# Altium schematic sheet 3V3 rail.SchDoc
size A
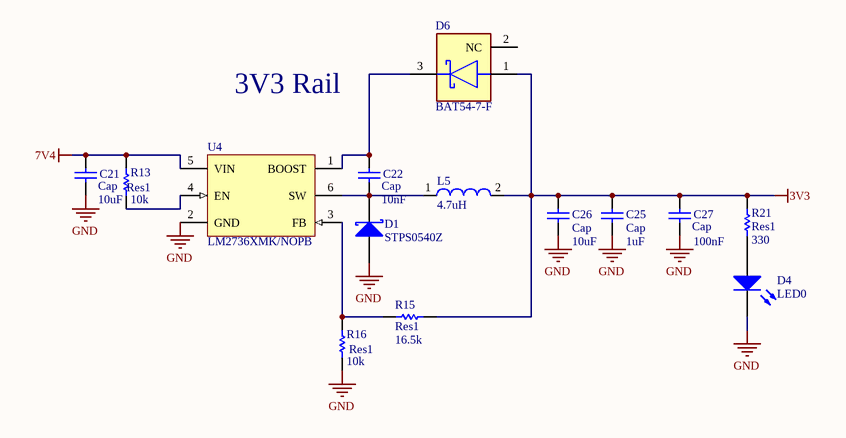
[diagram p0: 3V3 rail.SchDoc]

## Parts
C21  Cap  value 10uF  [6-0805_M]
C22  Cap  value 10nF  [0402-A]
C25  Cap  value 1uF  [1608[0603]]
C26  Cap  value 10uF  [6-0805_M]
C27  Cap  value 100nF  [1608[0603]]
D1  STPS0540Z  [STM-SOD-123-2_V]
D4  LED0  [1608[0603]]
D6  BAT54-7-F  [FP-SOT23-MFG]
L5  4.7uH  [WE-TPC-4818-M]
R13  Res1  value 10k  [0402-A]
R15  Res1  value 16.5k  [0402-A]
R16  Res1  value 10k  [0402-A]
R21  Res1  value 330  [0402-A]
U4  LM2736XMK/NOPB  [DDC0006A_L]

## Nets
3V3: C25.2 C26.2 C27.2 D6.1(A) L5.2 R15.1 R21.2
7V4: C21.2 R13.2 U4.5(VIN)
GND: C21.1 C25.1 C26.1 C27.1 D1.1(A) D4.2(K) R16.1 U4.2(GND)
NetC22_1: C22.1 D1.2(K) L5.1 U4.6(SW)
NetC22_2: C22.2 D6.3(C) U4.1(BOOST)
NetD4_1: D4.1(A) R21.1
NetR13_1: R13.1 U4.4(EN)
NetR15_2: R15.2 R16.2 U4.3(FB)

Not connected (* = marked no-connect by the designer): D6 2(NC)

## Notes on the sheet
- 3V3 Rail

## Library data of the parts
C21 C22 C25-C27 = Cap: Capacitor; Published: 8-Jun-2000; LatestRevisionDate: 17-Jul-2002; LatestRevisionNote: Re-released for DXP Platform.; PackageReference: RAD-0.3; Publisher: Altium Limited; PackageDescription: Radial Cap, Thru-Hole; 2 Leads; 0.3 in Pin Spacing
D1 = CMP-2000-07170-1: Schottky Rectifier, 0.5 A, 40 V, 2-Pin SOP (SOD-123), RoHS, Tape and Reel; Manufacturer: STMicroelectronics; SVHC: NoSVHC(15-Jun-2015); Forward Current If(AV): 500mA; Forward Voltage VF Max: 500mV; Repetitive Reverse Voltage Vrrm Max: 40V; No. of Pins: 2Pins; Forward Surge Current Ifsm Max: 5.5A; Diode Configuration: Single; Packaging: CutTape; Datasheet Version: 01/2002; Package Reference: SOD-123-2; Package Description: 2-Pin Small Outline Diode, Body 2.7 x 1.55 mm; Manufacturer URL: http://www.st.com/; Mounting Technology: SurfaceMount; Product Range: -; Operating Temperature Max: 150°C; Diode Case Style: SOD-123; Diode Type: Schottky; Datasheet URL: http://www.st.com/content/ccc/resource/technical/document/datasheet/group1/0f/03/9b/7c/50/58/48/d7/CD00001852/files/CD00001852.pdf/jcr:content/translations/en.CD00001852.pdf
D6 = CMP-0303-00002-2: DIODE SCHOTTKY 30V 200MA SOT23-3; Manufacturer: Diodes Inc.; Value: 10pF; Automotive Grade: NA; Max Junction Temp: +150°C; Peak Reverse Current: 2uA; Max Surge Forward Current: 600mA; Standoff Height: 0.013mm; Max Repetitive Reverse Voltage: 30V; Automotive: No; Package: SOT23; Category: Diode; Digikey Description: DIODE SCHOTTKY 30V 200MA SOT23-3; RoHS: TRUE; Temperature Range Low: -65°C; Device Class L3: Schottky Diodes; Footprint Url: https://www.diodes.com/assets/Package-Files/SOT23.pdf; Forward Current: 200mA; Reverse Voltage: 30V; Manufacturer Part Number: BAT54-7-F; Octopart: https://octopart.com/bat54-7-f-diodes+inc.-39681803; Lead Free: Yes; Temperature Range High: +150°C; ComponentLink2Description: Datasheet; Height: 1.1mm; Capacitance: 10pF; ComponentLink2URL: https://www.diodes.com/assets/Datasheets/ds11005.pdf; Temperature: -65°C to +150°C; Device Class L1: Discrete Semiconductors; Device Class L2: Diodes; Mouser Description: Switching diode SOT-23 30 V 200 mA
L5 = CMP-0227-00330-1: SMD Shielded Tiny Power Inductor WE-TPC, L = 4.70 µH; Inductance: 4.70 ÂµH; PackageVersion: 2010; ComponentLink2Description: Datasheet; ComponentLink2URL: http://www.we-online.de/katalog/media/pdf/744042004.pdf; PackageDescription: SMD Inductor, 2-Leads, Body 4.8 x 4.8 mm; ComponentLink1URL: http://www.we-online.com; PackageReference: WE-TPC-4818-M; ComponentLink1Description: Manufacturer Link; DatasheetVersion: ver 6, Aug-2010
R13 R15 R16 R21 = Res1: Resistor; Published: 8-Jun-2000; LatestRevisionDate: 17-Jul-2002; LatestRevisionNote: Re-released for DXP Platform.; PackageReference: AXIAL-0.3; Publisher: Altium Limited; PackageDescription: Axial Device, Thru-Hole; 2 Leads; 0.3 in Pin Spacing
U4 = CMP-0069-01211-3: 750mA Load Step-Down DC-DC Regulator, 6-pin Tiny SOT23, Pb-Free; Manufacturer: Texas Instruments; PowerWise: N; CompType: Switcher; PackageTopMarking: SHAB*XTT; Code_IPC: SOT26A-6; PackageDescription: Molded TSOT, 2.97 x 1.65 x 0.87mm Body, 6 Lead, 0.95mm Pitch; ComponentLink1Description: Datasheet URL; RoHS: Y; ComponentLink1URL: http://www.ti.com/general/docs/lit/getliterature.tsp?genericPartNumber=LM2736&fileType=pdf; PinCount: 6; PackageReference: DDC0006A; Code_JEDEC: MO-193-AA
D4 = LED0: Published: 8-Jun-2000; LatestRevisionDate: 08-Jul-2005; LatestRevisionNote: Mech Layer 1 removed.; PackageReference: LED-0; Publisher: Altium Limited; PackageDescription: LED; 2 Leads